# Altium schematic sheet 2-VoltProtector_CurrSens.SchDoc
size A4
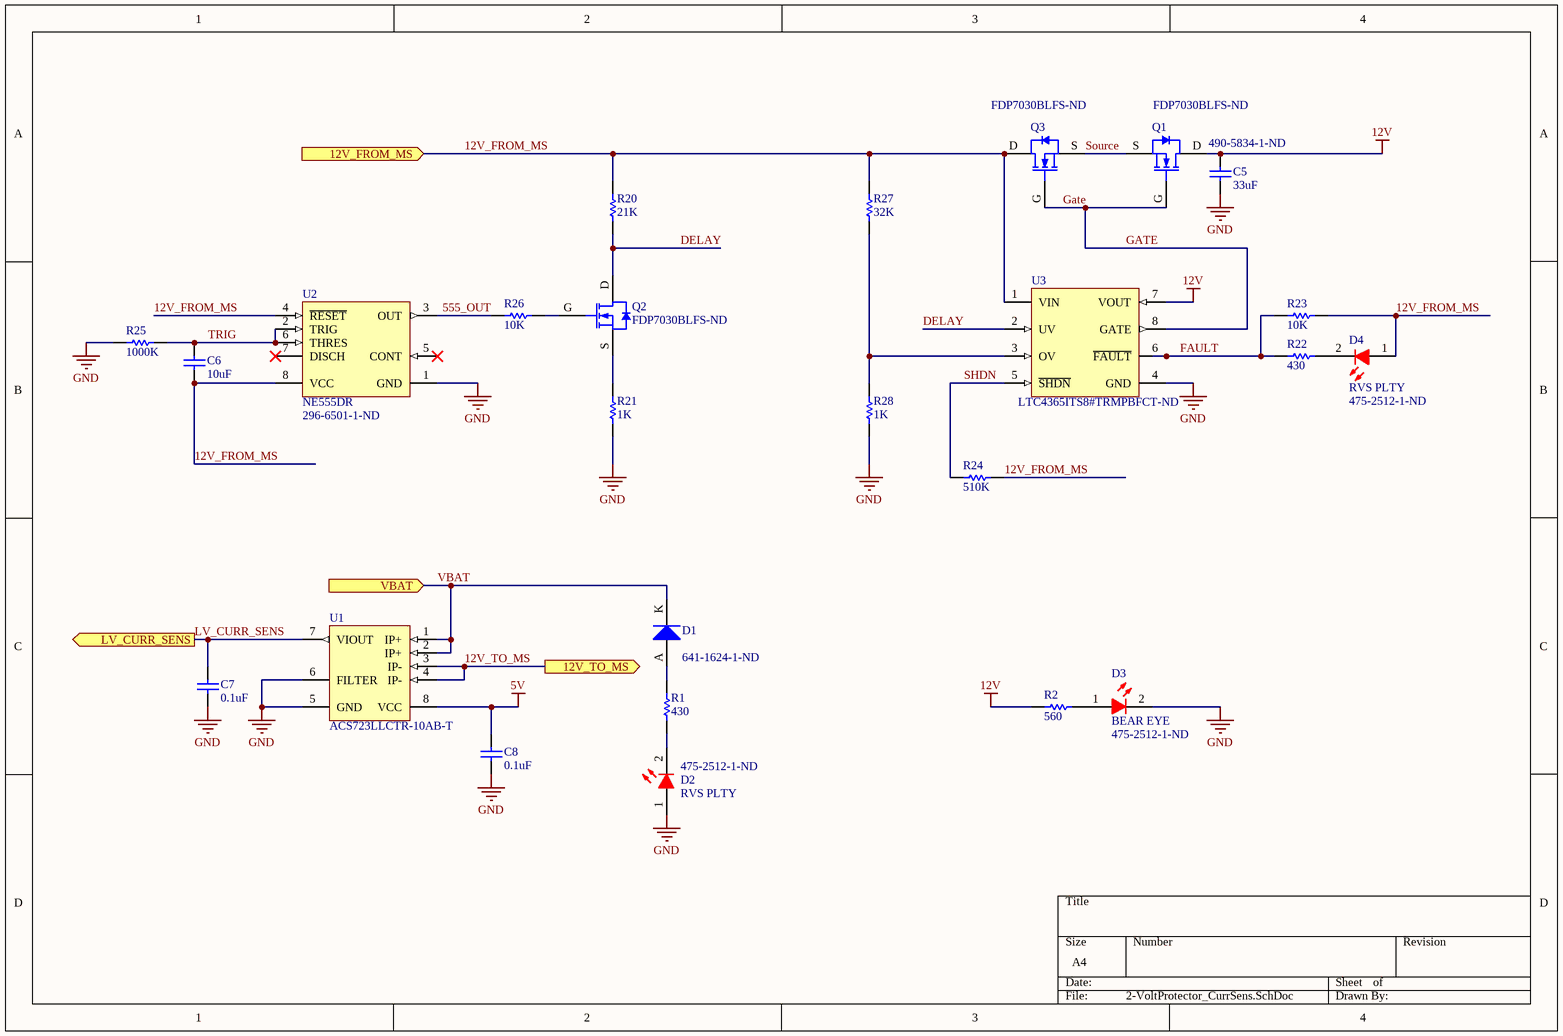
[diagram p0: 2-VoltProtector_CurrSens.SchDoc]

## Parts
C5  value 33uF  Supplier Part Number 1: 490-5834-1-ND  [2J-Lead 6.1 x 5.3]  (hidden comment: Cap Semi)
C6  value 10uF  [2J-Lead 6.1 x 5.3]  (hidden comment: Cap Semi)
C7  value 0.1uF  [1608[0603]]  (hidden comment: Cap Semi)
C8  value 0.1uF  [1608[0603]]  (hidden comment: Cap Semi)
D1  Supplier Part Number 1: 641-1624-1-ND  [SOD-123]
D2  RVS PLTY  Supplier Part Number 1: 475-2512-1-ND  [TOSH-0603LED_RED_V]
D3  BEAR EYE  Supplier Part Number 1: 475-2512-1-ND  [TOSH-0603LED_RED_V]
D4  RVS PLTY  Supplier Part Number 1: 475-2512-1-ND  [TOSH-0603LED_RED_V]
Q1  Supplier Part Number 1: FDP7030BLFS-ND  [TO220V-GDS]
Q2  Supplier Part Number 1: FDP7030BLFS-ND  [TO220V-GDS]
Q3  Supplier Part Number 1: FDP7030BLFS-ND  [TO220V-GDS]
R1  430  [RESC0603(1608)_L]
R2  560  [RESC0603(1608)_L]
R20  21K  [RESC0603(1608)_L]
R21  1K  [RESC0603(1608)_L]
R22  430  [RESC0603(1608)_L]
R23  10K  [RESC0603(1608)_L]
R24  510K  [RESC0603(1608)_L]
R25  1000K  [RESC0603(1608)_L]
R26  10K  [RESC0603(1608)_L]
R27  32K  [RESC0603(1608)_L]
R28  1K  [RESC0603(1608)_L]
U1  ACS723LLCTR-10AB-T  [ALEG-LC-8_V]
U2  NE555DR  Supplier Part Number 1: 296-6501-1-ND  [D0008A_M]
U3  Supplier Part Number 1: LTC4365ITS8#TRMPBFCT-ND  [LT-TS8-8-TSOT-23_V]  (hidden comment: LTC4365ITS8#TRMPBF)

## Ports
12V_FROM_MS (in), 12V_TO_MS (out), LV_CURR_SENS (out), VBAT (in)

## Nets
5V: C8.2 U1.8(VCC)
12V: C5.1 Q1.D R2.1 U3.7(VOUT)
GND: C5.2 C7.1 C8.1 D2.1(A) D3.2(K) R21.2 R25.2 R28.1 U1.5(GND) U1.6(FILTER) U2.1(GND) U3.4(GND)
12V_FROM_MS: C6.2 D4.1(A) Q3.D R20.1 R23.1 R24.1 R27.2 U2.4(~{RESET}) U2.8(VCC) U3.1(VIN) ; port 12V_FROM_MS
12V_TO_MS: U1.3(IP-) U1.4(IP-) ; port 12V_TO_MS
555_OUT: R26.2 U2.3(OUT)
DELAY: Q2.D R20.2 U3.2(UV)
FAULT: R22.1 R23.2 U3.6(~{FAULT})
GATE: Q1.G Q3.G U3.8(GATE)
LV_CURR_SENS: C7.2 U1.7(VIOUT) ; port LV_CURR_SENS
SHDN: R24.2 U3.5(~{SHDN})
Source: Q1.S Q3.S
TRIG: C6.1 R25.1 U2.2(TRIG) U2.6(THRES)
VBAT: D1.K U1.1(IP+) U1.2(IP+) ; port VBAT
NetD1_A: D1.A R1.2
NetD2_2: D2.2(K) R1.1
NetD3_1: D3.1(A) R2.2
NetD4_2: D4.2(K) R22.2
NetQ2_G: Q2.G R26.1
NetQ2_S: Q2.S R21.1
NetR27_1: R27.1 R28.2 U3.3(OV)

Not connected (* = marked no-connect by the designer): U2 5(CONT)* 7(DISCH)*

## Library data of the parts
C5-C8 = Cap Semi: Capacitor (Semiconductor SIM Model); Published: 8-Jun-2000; LatestRevisionDate: 29-May-2009; LatestRevisionNote: IPC-7351 Footprint Added.; PackageReference: C1206; Publisher: Altium Limited; PackageDescription: Chip Capacitor
  C5: Supplier 1: Digi-Key
  C7 C8: Supplier 1: Digi-Key; Supplier 2: Digi-Key; Supplier Part Number 2: 490-14359-1-ND
D1 = Diode 1N4003: 1 Amp General Purpose Rectifier; Published: 8-Jun-2000; LatestRevisionDate: 17-Jul-2002; LatestRevisionNote: Re-released for DXP Platform.; DatasheetVersion: 1998; PackageVersion: Aug-1999; PackageReference: DO-41; Publisher: Altium Limited; PackageDescription: Diode, Axial; Body 5.2 x 2.7 mm (LxDia. max), Lead Dia. 0.86 mm (max); Code_JEDEC: DO-204-AL; ComponentLink1Description: Manufacturer Link; ComponentLink1URL: http://www.fairchildsemi.com/; ComponentLink2Description: Datasheet; ComponentLink2URL: http://www.fairchildsemi.com/ds/1N%2F1N4001.pdf; Supplier 1: Digi-Key
D2-D4 = CMP-0444-00001-1: LED, Red 0603 (1608) 63mCd; Manufacturer: Toshiba; PartNumber: TLSU1008A(T04); Forward Current: 25 mA; Power Dissipation: 60 mW; Packing Type: Reel; Reverse Voltage: 4 V; Mounting Technology: Surface Mount; PackageDescription: 2-Pin SMT LED, 1.6 x 0.8 mm Pitch; ComponentLink1URL: http://www.toshiba-components.com/; ComponentLink1Description: Manufacturer URL; PackageReference: 0603LED_RED; ComponentLink2URL: http://www.semicon.toshiba.co.jp/info/docget.jsp?type=datasheet&lang=en&pid=TLSU1008A(T04); ComponentLink2Description: Datasheet; DatasheetVersion: Aug-08; Storage Temperature: -40 to 100 degC; Supplier 1: Digi-Key
Q1-Q3 = CMP-1058-00860-1: Power MOSFET, 40 V, 167 A, Single N-Channel, 3-Pin TO-220, Pb-Free, Tube; Qrr Typ (nC): 140; Channel Polarity: N Channel; Crss Typ (pF): 450; Ciss Typ (pF): 4300; Coss Typ (pF): 1075; ID Max (A): 167; PackageDescription: 3-Pin Flange Mount, Vertical Straight Lead, Body 9.97 x 4.445 mm, Pitch 2.54 mm; Configuration: Single; PackageVersion: Rev. AG, 09/2011; RoHS: Pb-Free; PackageReference: TO-220-3-221A-09; Package Type: TO-220-3; DatasheetVersion: Rev. 7; Packing: Tube; Mounting Technology: Through Hole; Supplier 1: Digi-Key
R1 R2 R20-R28 = CMP-1591-00001-1: 0603 (1608 Metric) Chip Resistor; Case-Metric: 1608; Case-EIA: 0603; PackageReference: RESC0603(1608)
  R1 R22: Supplier 1: Digi-Key; Supplier Part Number 1: P430BZCT-ND
  R2: Supplier 1: Digi-Key; Supplier Part Number 1: P560BZCT-ND
  R23 R26: Supplier 1: Digi-Key; Supplier Part Number 1: 311-10KGRCT-ND
  R25 R27 R28: Supplier 1: Digi-Key
U1 = CMP-0826-00001-1: Linear Current Sensor IC, 4.5 to 5.5 V Supply Voltage, 10 mA Supply Current, -40 to 85 degC, 8-Pin SOIC (LC), RoHS, Tape and Reel; Manufacturer: Allegro Microsystems; PartNumber: ACS712ELCTR-20A-T; CLOAD: 10 nF Max.; ICC: 10 mA; F: 80 kHz; RLOAD: 4.7 kOhm Min.; Optimized Accuracy Range: +/- 20 A; TR: 3.5 us; Sensitivity Sens: 100 mV/A Typ.; Operating Temperature Range: -40 to 85 degC; ComponentLink2URL: http://www.allegromicro.com/~/media/Files/Datasheets/ACS712-Datasheet.ashx; ComponentLink1Description: Manufacturer URL; VCC: 4.5 to 5.5 V; Mounting Technology: Surface Mount; DatasheetVersion: Rev. 15; ComponentLink2Description: Datasheet; ComponentLink1URL: http://www.allegromicro.com/; PackageDescription: 8-Pin SOIC, Body 4.9 x 3.9 mm, Pitch 1.27 mm; PackageReference: LC-8; RoHS: TRUE; Packing: Tape and Reel; Supplier 1: Digi-Key; Supplier Part Number 1: 620-1190-1-ND
U2 = CMP-1685-00007-1: Precision Timer, 4.5 to 16 V, 0 to 70 degC, 8-Pin SOIC (D8), Green (RoHS & no Sb/Br), Tape and Reel; Forward Voltage: 450 mV; Forward Current: 1 A; Max Surge Current: 30 A; Peak Reverse Current: 500 uA; Case\Package: SMA; PackageReference: D0008A; Width: 2.84 mm; PackageDescription: 8-Pin Small Outline Integrated Circuit, Body 4.9 x 3.9 mm, Pitch 1.27 mm; DatasheetVersion: SLFS022I, 09/2014; ComponentLink2Description: Datasheet; Package Quantity: 1; REACH SVHC: Unknown; Radiation Hardening: No; Height: 2.44 mm; Code_JEDEC: MS-012; Pins: 2; ComponentLink1Description: Manufacturer URL; ComponentLink3Description: Package Specification; ComponentLink3URL: http://www.ti.com/lit/ml/msoi002j/msoi002j.pdf; Length: 4.57 mm; ComponentLink1URL: http://www.ti.com/; Mount: Surface Mount; PackageVersion: 4040047-3/M, 06/2011; ComponentLink2URL: http://www.ti.com/general/docs/lit/getliterature.tsp?genericPartNumber=NE555&fileType=pdf; RoHSCompliant: true; Max Operating Temperature: 125 degC; Packaging: Cut Tape; Min Operating Temperature: -55 degC; Supplier 1: Digi-Key
U3 = CMP-0474-00861-1: UV, OV and Reverse Supply Protection Controller, 2.5 to 34 V Vin, 8-pin SOT23 (TS8-8), -40 to 85 degC, Pb-Free, Mini Tape and Reel; Manufacturer: Linear Technology; Fault: yes; Fast Comparator: no; Extended Temp: C, I, H; Circuit Breakers(#): 1; RoHS: TRUE; ComponentLink2URL: http://cds.linear.com/docs/en/datasheet/4365f.pdf; PartNumber: LTC4365ITS8#TRMPBF; ComponentLink3Description: Package Specification; Power Good: no; Packing: Mini Tape and Reel; ComponentLink2Description: Datasheet; Vin Range: 2.5 to 34 V; Active Limiting: no; Foldback: no; Reset: no; ComponentLink3URL: http://cds.linear.com/docs/en/packaging/SOT_8_05-08-1637.pdf; PackageVersion: Rev. A, 08/2010; Code_JEDEC: MO-193; ComponentLink1Description: Manufacturer URL; Mounting Technology: Surface Mount; ComponentLink1URL: http://www.linear.com/; PackageDescription: 8-Pin Plastic TSOT-23, Body 2.9 x 1.63 mm, Pitch 0.65 mm; PackageReference: TS8-8; Supplier 1: Digi-Key